# Altium schematic sheet PA_Schem.SchDoc: 2.4GHz PA Q0100
size OrCAD B; Author: Salil Tembe; Address1: Mumbai; SheetNumber: 1
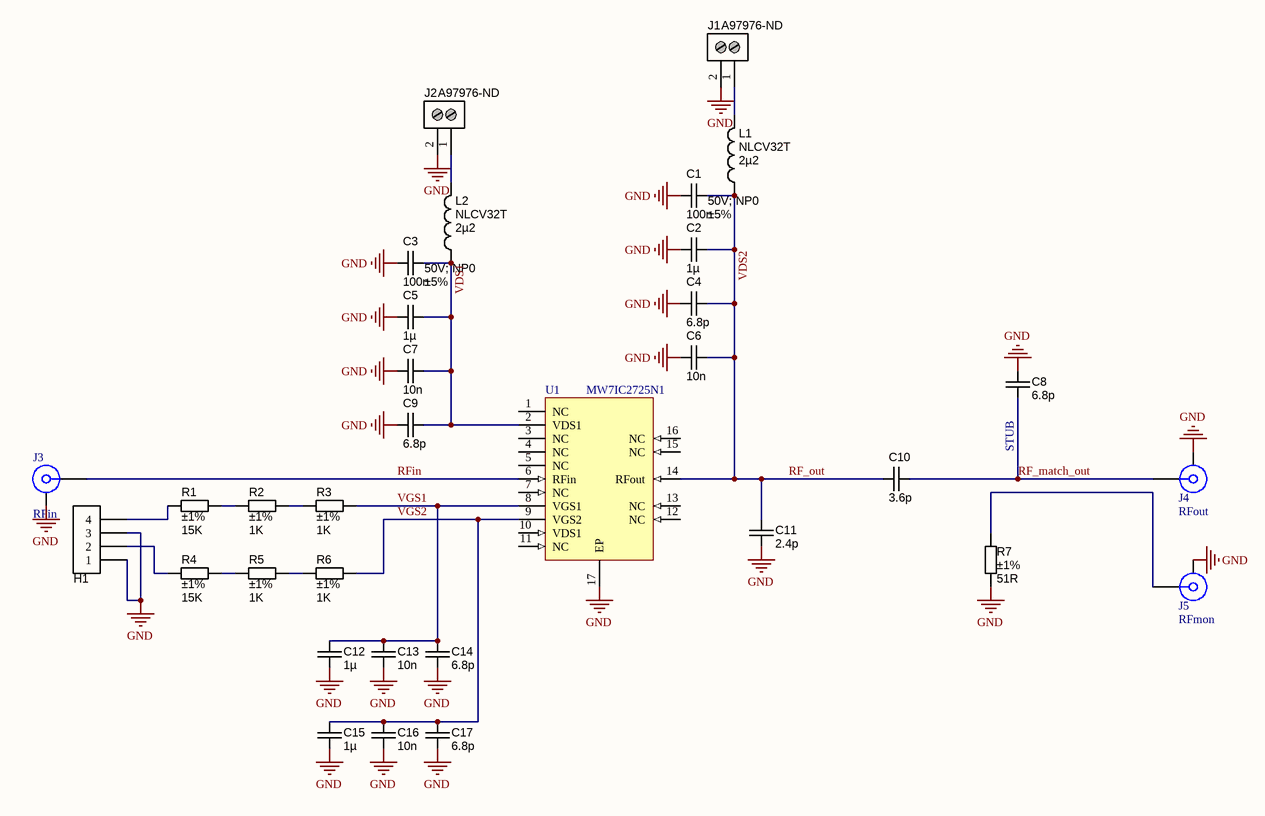
[diagram p0: PA_Schem.SchDoc]

## Parts
C1  Tolerance: ±5%  Ratings: 50V; NP0  [CAPC3216X180N]  (hidden comment: 100n)
C2  value 1µ  [CAPC1608X90N]  (hidden comment: approved sub OK)
C3  Tolerance: ±5%  Ratings: 50V; NP0  [CAPC3216X180N]  (hidden comment: 100n)
C4  6.8p  [CAPC1608X90N]
C5  value 1µ  [CAPC1608X90N]  (hidden comment: approved sub OK)
C6  value 10n  [CAPC1608X90N]  (hidden comment: approved sub OK)
C7  value 10n  [CAPC1608X90N]  (hidden comment: approved sub OK)
C8  6.8p  [CAPC1608X90N]
C9  6.8p  [CAPC1608X90N]
C10  3.6p  [CAPC1608X90N]
C11  2.4p  [CAPC1608X90N]
C12  value 1µ  [CAPC1608X90N]  (hidden comment: approved sub OK)
C13  value 10n  [CAPC1608X90N]  (hidden comment: approved sub OK)
C14  6.8p  [CAPC1608X90N]
C15  value 1µ  [CAPC1608X90N]  (hidden comment: approved sub OK)
C16  value 10n  [CAPC1608X90N]  (hidden comment: approved sub OK)
C17  6.8p  [CAPC1608X90N]
H1  Programmer  [HDR1X4_2.54MMP]  (value not drawn)  (no BOM)
J1  Supplier Part Number 1: A97976-ND  [2P_PCB_ScrewTerm_90S_3.81MM]  (hidden comment: Stackable ScrewTerm)
J2  Supplier Part Number 1: A97976-ND  [2P_PCB_ScrewTerm_90S_3.81MM]  (hidden comment: Stackable ScrewTerm)
J3  RFin  [ROS-32K145-400L5_V]
J4  RFout  [ROS-32K145-400L5_V]
J5  RFmon  [ROS-32K145-400L5_V]
L1  NLCV32T  value 2µ2  [INDM3225X240N]
L2  NLCV32T  value 2µ2  [INDM3225X240N]
R1  value 15K  Tolerance: ±1%  [RESC1608X55N]  (hidden comment: Thick Film)
R2  value 1K  Tolerance: ±1%  [RESC1608X55N]  (hidden comment: Thick Film)
R3  value 1K  Tolerance: ±1%  [RESC1608X55N]  (hidden comment: Thick Film)
R4  value 15K  Tolerance: ±1%  [RESC1608X55N]  (hidden comment: Thick Film)
R5  value 1K  Tolerance: ±1%  [RESC1608X55N]  (hidden comment: Thick Film)
R6  value 1K  Tolerance: ±1%  [RESC1608X55N]  (hidden comment: Thick Film)
R7  value 51R  Tolerance: ±1%  [RESC1608X55N]  (hidden comment: Thick Film)
U1  MW7IC2725N1  [CFP102P1410X258-16N]

## Nets
GND: C1.1 C2.2 C3.1 C4.2 C5.2 C6.2 C7.2 C8.1 C9.2 C11.2 C12.2 C13.2 C14.2 C15.2 C16.2 C17.2 H1.1 H1.3 J1.2 J2.2 J3.MP J4.MP J5.MP R7.2 U1.17(EP)
RF_match_out: C8.2 C10.1 J4.1
RF_out: C1.2 C2.1 C4.1 C6.1 C10.2 C11.1 L1.1 U1.14(RFout)  [also labelled VDS2]
RFin: J3.1 U1.6(RFin)
VDS1: C3.2 C5.1 C7.1 C9.1 L2.1 U1.2(VDS1)
VGS1: C12.1 C13.1 C14.1 R3.2 U1.8(VGS1)
VGS2: C15.1 C16.1 C17.1 R6.2 U1.9(VGS2)
NetH1_2: H1.2 R4.1
NetH1_4: H1.4 R1.1
NetJ1_1: J1.1 L1.2
NetJ2_1: J2.1 L2.2
NetJ5_1: J5.1 R7.1
NetR1_2: R1.2 R2.1
NetR2_2: R2.2 R3.1
NetR4_2: R4.2 R5.1
NetR5_2: R5.2 R6.1

Not connected (* = marked no-connect by the designer): U1 1(NC) 3(NC) 4(NC) 5(NC) 7(NC) 10(VDS1) 11(NC) 12(NC) 13(NC) 15(NC) 16(NC)

## Notes on the sheet
- (near C8) STUB
- Title
- Size:
- Date:
- Orcad B
- Number:
- Time:
- Revision:
- Sheet
- of
- File:

## Library data of the parts
C1 C3 = CAPC_100n_1206_NP0_50V_5%: Capacitor SMD Cer 100nF 1206 NP0 50V 5%; Manufacturer 1: TDK Corporation; Manufacturer Part Number 1: C3216C0G1H104J160AA; SCDType: undef; Operating Temperature: -55°C ~ 125°C; Package / Case: 1206 (3216 Metric); Size / Dimension: 0.126" L x 0.063" W (3.20mm x 1.60mm); Thickness (Max): 0.075" (1.90mm); Supplier 1: Digi-Key; Supplier Part Number 1: 445-7694-1-ND; ComponentLink1URL: http://product.tdk.com/capacitor/mlcc/en/documents/mlcc_commercial_general_en.pdf; ComponentLink1Description: http://product.tdk.com/capacitor/mlcc/en/documents/mlcc_commercial_general_en.pdf; Value: 100n
C2 C5 C12 C15 = CAPC_1u_0603_X7R_16V_10%: Capacitor SMD Cer 1uF 10% 16V X7R 0603; Manufacturer 1: TDK Corporation; Manufacturer Part Number 1: C1608X7R1C105K; Ratings: 16V; X7R; Material: ceramic; SCDType: spec; Package / Case: 0603 (1608 metric); Tolerance: ±10%; Supplier 1: Digi-Key; Supplier Part Number 1: 445-1604-1-ND; ComponentLink1URL: http://product.tdk.com/capacitor/mlcc/en/documents/mlcc_commercial_general_en.pdf; ComponentLink1Description: http://product.tdk.com/capacitor/mlcc/en/documents/mlcc_commercial_general_en.pdf
C4 C8-C11 C14 C17 = CAPC_8p_0603_NP0_50V: Capacitor SMD Cer 8pF ±0.5pF 50V NP0 0603; Manufacturer 1: Murata Electronics North America; Manufacturer Part Number 1: GRM1885C1H8R0DZ01D; Ratings: 50V; NP0; SCDType: undef; Tolerance: ±0.5pF; Operating Temperature: -55°C ~ 125°C; Package / Case: 0603 (1608 Metric); Size / Dimension: 0.063" L x 0.032" W (1.60mm x 0.81mm); Thickness (Max): 0.035" (0.90mm); Supplier 1: Digi-Key; Supplier Part Number 1: 490-1399-1-ND; ComponentLink1URL: http://search.murata.co.jp/Ceramy/image/img/PDF/ENG/GRM1885C1H8R0DZ01.pdf; ComponentLink1Description: GRM1885C1H8R0DZ01 datasheet.pdf
  C4 C8 C9 C14 C17: Value: 6.8p
  C10: Value: 3.6p
  C11: Value: 2.4p
C6 C7 C13 C16 = CAPC_10n_0603_X7R_100V_10%: Capacitor SMD Cer 10nF 10% 100V X7R 0603; Manufacturer: Murata Electronics North America; Manufacturer Part Number: GCM188R72A103KA37D; Ratings: 100V; X7R; Material: ceramic; SCDType: undef; Package / Case: 0603 (1608 metric); Tolerance: ±10%; Supplier 1: Digi-Key; Supplier Part Number 1: 490-4781-1-ND
H1 = Header4P: Header 4-pin
J1 J2 = 2P_ScrewTerm_90S_3.81MM: Terminal Block Screw Type THT 2-Position 3.81mm pitch; Manufacturer 1: Tyco Electronics; Manufacturer Part Number 1: 1776113-2; Value: 2 position; Pitch: 0.150" (3.81mm); Positions Per Level: 2; SCDType: undef; Package / Case: Side Entry; 3.81mm pitch; Category: Connectors Interconnects; Color: Black; Supplier 1: Digi-Key
J3-J5 = 32K145-400L5: SMA Right Angle Jack, Edge Mount, Up to 18 GHz, -55 to 155 degC; Design Note 1: Footprint in library is a generic example - only application specific footprint delivers High Performance; Desgin Note 2: For more information about DRC setting, please look at following webpage, http://techdocs.altium.com/display/SCRT/Design+Rule+for+Edge-Mount+Connectors; DatasheetVersion: b00; PackageVersion: b00; PackageReference: 32K145-400L5; PackageDescription: SMA Right Angle Jack, Edge Mount, 14.25 x 9.5 x 4.46 mm; Mounting Technology: Surface Mount; PartNumber: 32K145-400L5; ComponentLink1Description: Manufacturer URL; ComponentLink1URL: http://www.rosenberger.de; ComponentLink2Description: Datasheet; ComponentLink2URL: http://rosenberger.de/ok/images/documents/db/32K145-400L5.pdf; ComponentLink3Description: Package Specification; ComponentLink3URL: http://rosenberger.de/ok/images/documents/db/32K145-400L5.pdf; ComponentLink4Description: Series Overview / Design Note; ComponentLink4URL: http://rosenberger.de/ok/images/documents/spez/32.pdf; ComponentLink5Description: Webshop / RFQ; ComponentLink5URL: http://www.rosenberger.com/en/contact/sales/
L1 L2 = INDC_2u2_1210_1200mA: Inductor 2.2uH 1.2A 1210 SMD chip; Manufacturer 1: TDK Corporation; Manufacturer Part Number 1: NLCV32T-2R2M-PFR; Ratings: 1.2 Adc; Tolerance: ±20%; Type: Ferrite Core; DC Resistance (DCR): 115 mOhm; Q @ Freq: 15 @ 7.96MHz; Frequency - Self Resonant: 68MHz; Frequency - Test: 7.96MHz; SCDType: source; Package / Case: 1210 (3225 Metric); Supplier 1: Digi-Key; Supplier Part Number 1: 445-3650-1-ND; ComponentLink1URL: http://www.tdk.co.jp/tefe02/e511_nlcv_nlc.pdf; ComponentLink1Description: http://www.tdk.co.jp/tefe02/e511_nlcv_nlc.pdf; Operating Temperature: -40°C ~ 125°C
R1 R4 = RES_15K_0603_1%: Resistor SMD chip 15k Ohm 0.1W 1% 0603; Manufacturer 1: Rohm Semiconductor; Manufacturer Part Number 1: MCR03ERTF1502; Ratings: 1/10 W; SCDType: spec; Package / Case: 0603 (1608 metric); Material: Thick Film; Supplier 1: Digi-Key; Supplier Part Number 1: RHM15.0KCFCT-ND; RoHS 1: RoHS Compliant; ComponentLink1URL: http://rohmfs.rohm.com/en/products/databook/datasheet/passive/resistor/chip_resistor/mcr_g.pdf; ComponentLink1Description: http://rohmfs.rohm.com/en/products/databook/datasheet/passive/resistor/chip_resistor/mcr_g.pdf; Supplier 2: Digi-Key; Supplier Part Number 2: 311-15.0KHRCT-ND; Manufacturer 2: Yageo; Manufacturer Part Number 2: RC0603FR-0715KL; RoHS 2: RoHS Compliant; ComponentLink2URL: http://www.yageo.com/documents/recent/PYu-RC0603_51_RoHS_L_4.pdf; ComponentLink2Description: http://www.yageo.com/documents/recent/PYu-RC0603_51_RoHS_L_4.pdf; Supplier 3: Digi-Key; Supplier Part Number 3: P15.0KHCT-ND; Manufacturer 3: Panasonic Electronic Components; Manufacturer Part Number 3: ERJ-3EKF1502V; RoHS 3: RoHS Compliant; ComponentLink3URL: http://industrial.panasonic.com/www-cgi/jvcr13pz.cgi?E+PZ+3+AOA0002+ERJ3EKF1502V+7+WW; ComponentLink3Description: http://industrial.panasonic.com/www-cgi/jvcr13pz.cgi?E+PZ+3+AOA0002+ERJ3EKF1502V+7+WW; Supplier 4: Digi-Key; Supplier Part Number 4: RMCF0603FT15K0CT-ND; Manufacturer 4: Stackpole Electronics Inc; Manufacturer Part Number 4: RMCF0603FT15K0; RoHS 4: RoHS Compliant; ComponentLink4URL: http://www.seielect.com/Catalog/SEI-RMCF_RMCP.pdf; ComponentLink4Description: http://www.seielect.com/Catalog/SEI-RMCF_RMCP.pdf; Supplier 5: Digi-Key; Supplier Part Number 5: 541-15.0KSCT-ND; Manufacturer 5: Vishay Dale; Manufacturer Part Number 5: CRCW060315K0FKEAHP; RoHS 5: RoHS Compliant; ComponentLink5URL: http://www.vishay.com/docs/20043/crcwhpe3.pdf; ComponentLink5Description: http://www.vishay.com/docs/20043/crcwhpe3.pdf
R2 R3 R5 R6 = RES_1K_0603_1%: Resistor SMD chip 1k Ohm 0.1W 1% 0603; Manufacturer 1: Yageo; Manufacturer Part Number 1: RC0603FR-071KL; Ratings: 1/10W; SCDType: spec; Package / Case: 0603 (1608 Metric); Supplier 1: Digi-Key; Supplier Part Number 1: 311-1.00KHRCT-ND
R7 = RES_51R_0603_1%: Resistor SMD chip 51 Ohm 0.1W 1% 0603; Manufacturer 1: Yageo; Manufacturer Part Number 1: RC0603FR-0751RL; Ratings: 1/10 W; SCDType: spec; Package / Case: 0603 (1608 metric); Material: Thick Film; Supplier 1: Digi-Key; Supplier Part Number 1: 311-51.0HRCT-ND
U1 = MW7IC2725N1: The MW7IC2725N wideband integrated circuit is designed with on- chip / matching that makes it usable from 2300- 2700 MHz. This multi- stage / structure is rated for 26 to 32 Volt operation and covers all typical cellular / base station modulation formats.; ComponentLink1Description: Datasheet; ComponentLink1URL: https://www.nxp.com/docs/en/data-sheet/MW7IC2725N.pdf